# Altium project CCZynq.PrjPCB (part 2 of 2)
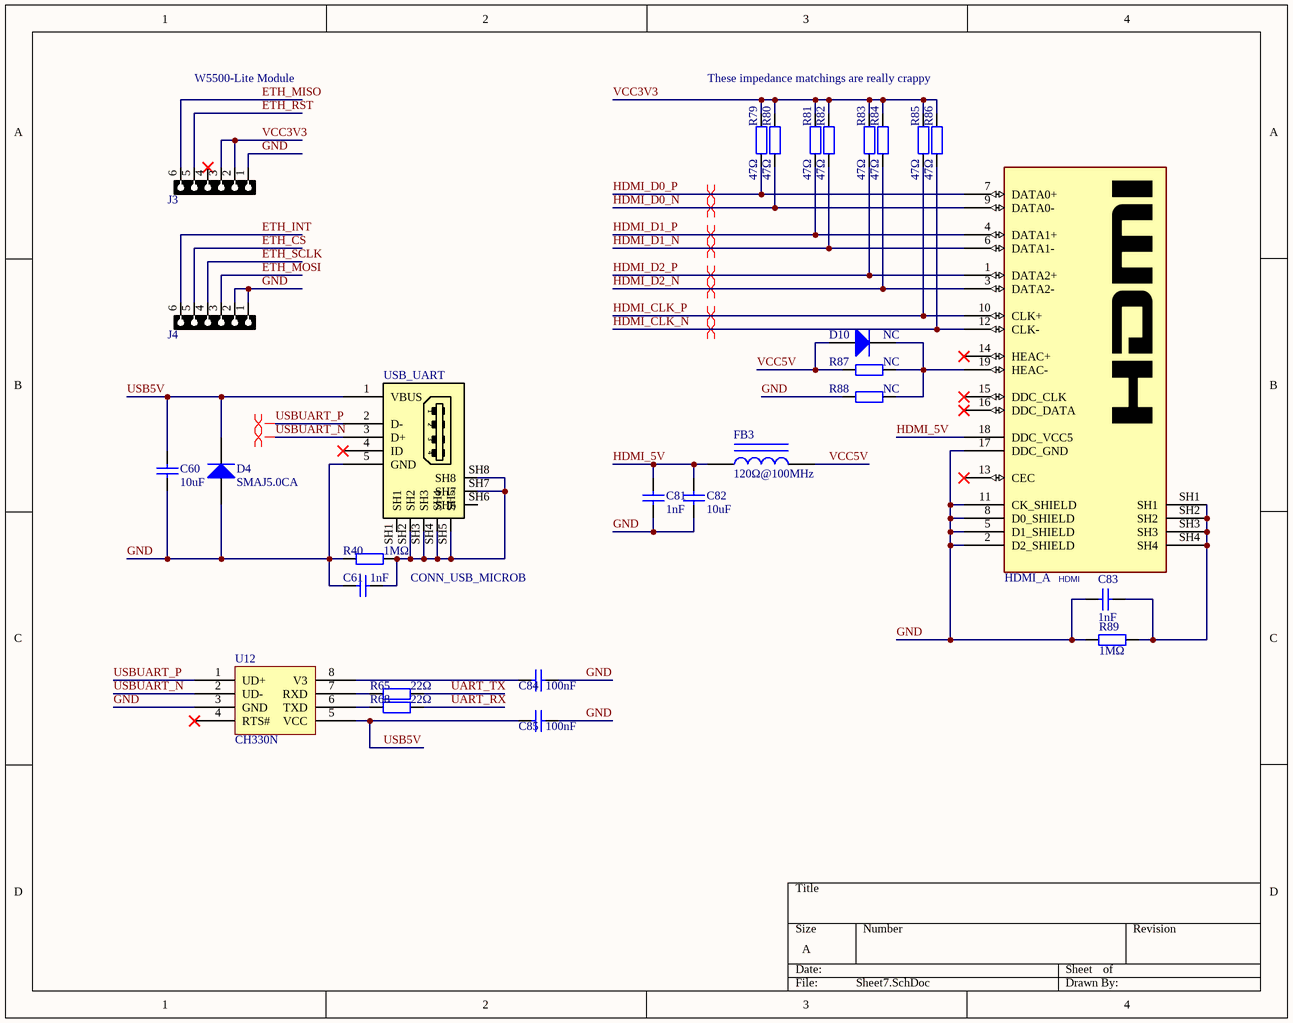
[diagram p7: Sheet7.SchDoc]

## Nets that join several sheets
BTN0: Sheet3 (U1.L15), Sheet6 (PMOD4+.7 R69.2)
BTN1: Sheet3 (U1.P19), Sheet6 (PMOD4+.8 R70.2)
CE_B1: Sheet3 (U1.U14), Sheet5 (5 pins)
CE_B2: Sheet3 (U1.G14), Sheet5 (5 pins)
ETH_CS: Sheet3 (U1.U18), Sheet7 (J4.5)
ETH_INT: Sheet3 (U1.L19), Sheet7 (J4.6)
ETH_MISO: Sheet3 (U1.R16), Sheet7 (J3.6)
ETH_MOSI: Sheet3 (U1.V18), Sheet7 (J4.3)
ETH_RST: Sheet3 (U1.T17), Sheet7 (J3.5)
ETH_SCLK: Sheet3 (U1.L20), Sheet7 (J4.4)
GND: Sheet1 (103 pins), Sheet2 (28 pins), Sheet4 (44 pins), Sheet6 (24 pins), Sheet5 (34 pins), Sheet7 (21 pins)
GNDADC: Sheet1 (C8.2 FB1.2 U1.J10), Sheet2 (C47.1 U1.K10)
HDMI_CLK_N: Sheet3 (U1.W20), Sheet7 (HDMI.12 R86.1)
HDMI_CLK_P: Sheet3 (U1.V20), Sheet7 (HDMI.10 R85.1)
HDMI_D0_N: Sheet3 (U1.M18), Sheet7 (HDMI.9 R80.1)
HDMI_D0_P: Sheet3 (U1.M17), Sheet7 (HDMI.7 R79.1)
HDMI_D1_N: Sheet3 (U1.L17), Sheet7 (HDMI.6 R82.1)
HDMI_D1_P: Sheet3 (U1.L16), Sheet7 (HDMI.4 R81.1)
HDMI_D2_N: Sheet3 (U1.P20), Sheet7 (HDMI.3 R84.1)
HDMI_D2_P: Sheet3 (U1.N20), Sheet7 (HDMI.1 R83.1)
IO1: Sheet3 (U1.K19), Sheet5 (PMOD2.4)
IO2: Sheet3 (U1.K16), Sheet5 (PMOD2.2)
IO3: Sheet3 (U1.K18), Sheet5 (PMOD2.1)
IO4: Sheet3 (U1.H17), Sheet5 (PMOD2.3)
IO5: Sheet3 (U1.G18), Sheet5 (PMOD2.5)
IO6: Sheet3 (U1.E19), Sheet5 (PMOD2.7)
LED0: Sheet3 (U1.U20), Sheet6 (LED0.A PMOD4+.2)
LED1: Sheet3 (U1.T19), Sheet6 (LED1.A PMOD4+.1)
LED2: Sheet3 (U1.U17), Sheet6 (LED2.A PMOD4+.4)
LED3: Sheet3 (U1.V17), Sheet6 (LED3.A PMOD4+.3)
P1_N: Sheet3 (U1.D20), Sheet5 (PMOD1.3)
P1_P: Sheet3 (U1.D19), Sheet5 (PMOD1.1)
P2_N: Sheet3 (U1.B20), Sheet5 (PMOD1.4)
P2_P: Sheet3 (U1.C20), Sheet5 (PMOD1.2)
P3_N: Sheet3 (U1.G20), Sheet5 (PMOD1.7)
P3_P: Sheet3 (U1.G19), Sheet5 (PMOD1.5)
P4_N: Sheet3 (U1.F20), Sheet5 (PMOD1.8)
P4_P: Sheet3 (U1.F19), Sheet5 (PMOD1.6)
P5_N: Sheet3 (U1.A20), Sheet5 (PMOD2.8)
P5_P: Sheet3 (U1.B19), Sheet5 (PMOD2.6)
Q1_N: Sheet3 (U1.U12), Sheet6 (PMOD4+.15)
Q1_P: Sheet3 (U1.T12), Sheet6 (PMOD4+.16)
Q2_N: Sheet3 (U1.V13), Sheet6 (PMOD4+.13)
Q2_P: Sheet3 (U1.U13), Sheet6 (PMOD4+.14)
Q3_N: Sheet3 (U1.Y14), Sheet6 (PMOD4+.12)
Q3_P: Sheet3 (U1.W14), Sheet6 (PMOD4+.11)
Q4_N: Sheet3 (U1.Y19), Sheet6 (PMOD4+.10)
Q4_P: Sheet3 (U1.Y18), Sheet6 (PMOD4+.9)
SCK_B1: Sheet3 (U1.V12), Sheet5 (U4.6 U6.6 U8.6 U10.6)
SCK_B2: Sheet3 (U1.E17), Sheet5 (U5.6 U7.6 U9.6 U11.6)
SD_CMD: Sheet3 (U1.P18), Sheet6 (J2.3 R64.1)
SD_DAT0: Sheet3 (U1.N17), Sheet6 (J2.7 R63.1)
SD_DAT1: Sheet3 (U1.M19), Sheet6 (J2.8 R62.1)
SD_DAT2: Sheet3 (U1.R18), Sheet6 (J2.1 R61.1)
SD_DAT3: Sheet3 (U1.R17), Sheet6 (J2.2 R60.1)
SD_NCD: Sheet3 (U1.M20), Sheet6 (R66.1 R67.2)
SD_SCK: Sheet3 (U1.N18), Sheet6 (J2.5)
SI_B1C1: Sheet3 (U1.T15), Sheet5 (U4.5)
SI_B1C2: Sheet3 (U1.U15), Sheet5 (U6.5)
SI_B1C3: Sheet3 (U1.V16), Sheet5 (U8.5)
SI_B1C4: Sheet3 (U1.W19), Sheet5 (U10.5)
SI_B2C1: Sheet3 (U1.J15), Sheet5 (U5.5)
SI_B2C2: Sheet3 (U1.G17), Sheet5 (U7.5)
SI_B2C3: Sheet3 (U1.G15), Sheet5 (U9.5)
SI_B2C4: Sheet3 (U1.E18), Sheet5 (U11.5)
SIO2_B1C1: Sheet3 (U1.R14), Sheet5 (U4.3)
SIO2_B1C2: Sheet3 (U1.T10), Sheet5 (U6.3)
SIO2_B1C3: Sheet3 (U1.W13), Sheet5 (U8.3)
SIO2_B1C4: Sheet3 (U1.Y16), Sheet5 (U10.3)
SIO2_B2C1: Sheet3 (U1.M14), Sheet5 (R50.1 U5.3)
SIO2_B2C2: Sheet3 (U1.P16), Sheet5 (R51.1 U7.3)
SIO2_B2C3: Sheet3 (U1.J14), Sheet5 (R52.1 U9.3)
SIO2_B2C4: Sheet3 (U1.H16), Sheet5 (R53.1 U11.3)
SIO3_B1C1: Sheet3 (U1.V15), Sheet5 (U4.7)
SIO3_B1C2: Sheet3 (U1.T16), Sheet5 (U6.7)
SIO3_B1C3: Sheet3 (U1.W18), Sheet5 (U8.7)
SIO3_B1C4: Sheet3 (U1.Y17), Sheet5 (U10.7)
SIO3_B2C1: Sheet3 (U1.F16), Sheet5 (R54.1 U5.7)
SIO3_B2C2: Sheet3 (U1.D18), Sheet5 (R56.1 U7.7)
SIO3_B2C3: Sheet3 (U1.H15), Sheet5 (R57.1 U9.7)
SIO3_B2C4: Sheet3 (U1.J16), Sheet5 (R58.1 U11.7)
SO_B1C1: Sheet3 (U1.T14), Sheet5 (U4.2)
SO_B1C2: Sheet3 (U1.T11), Sheet5 (U6.2)
SO_B1C3: Sheet3 (U1.W15), Sheet5 (U8.2)
SO_B1C4: Sheet3 (U1.W16), Sheet5 (U10.2)
SO_B2C1: Sheet3 (U1.N15), Sheet5 (U5.2)
SO_B2C2: Sheet3 (U1.L14), Sheet5 (U7.2)
SO_B2C3: Sheet3 (U1.K14), Sheet5 (U9.2)
SO_B2C4: Sheet3 (U1.F17), Sheet5 (U11.2)
SW0: Sheet3 (U1.R19), Sheet6 (PMOD4+.5 R71.2)
SW1: Sheet3 (U1.T20), Sheet6 (PMOD4+.6 R72.2)
SYSCLK: Sheet3 (U1.U19), Sheet5 (R55.1)
SYSCLK2: Sheet3 (U1.K17), Sheet5 (R59.1)
TCK_O: Sheet2 (JTAG_STD.5 R17.1 R24.2), Sheet4 (J_FT_AD.1)
TDI_O: Sheet2 (JTAG_STD.9 R16.1 R26.2), Sheet4 (J_FT_AD.2)
TDO_O: Sheet2 (JTAG_STD.7 R25.2), Sheet4 (J_FT_AD.3)
TMS_O: Sheet2 (JTAG_STD.3 R18.1 R21.2), Sheet4 (J_FT_AD.4)
UART_RX: Sheet3 (U1.P14), Sheet4 (R43.1), Sheet7 (R68.2)
UART_TX: Sheet3 (U1.P15), Sheet4 (R42.1), Sheet7 (R65.2)
USB5V: Sheet4 (R45.2 R46.2), Sheet7 (5 pins)
USBD2_N: Sheet3 (U1.H20), Sheet6 (USB_PS2.B2)
USBD2_P: Sheet3 (U1.J20), Sheet6 (USB_PS2.B3)
USBnINT: Sheet3 (U1.H18), Sheet6 (U13.1)
USBRXD: Sheet3 (U1.J19), Sheet6 (U13.6)
USBTXD: Sheet3 (U1.J18), Sheet6 (U13.5)
VCC1V0: Sheet1 (32 pins), Sheet4 (7 pins)
VCC1V8: Sheet1 (28 pins), Sheet4 (7 pins)
VCC3V3: Sheet1 (44 pins), Sheet2 (25 pins), Sheet4 (7 pins), Sheet6 (18 pins), Sheet5 (32 pins), Sheet7 (10 pins)
VCC5V: Sheet4 (15 pins), Sheet6 (USB_PS2.A1 USB_PS2.B1), Sheet7 (D10.1 FB3.2 R87.2)